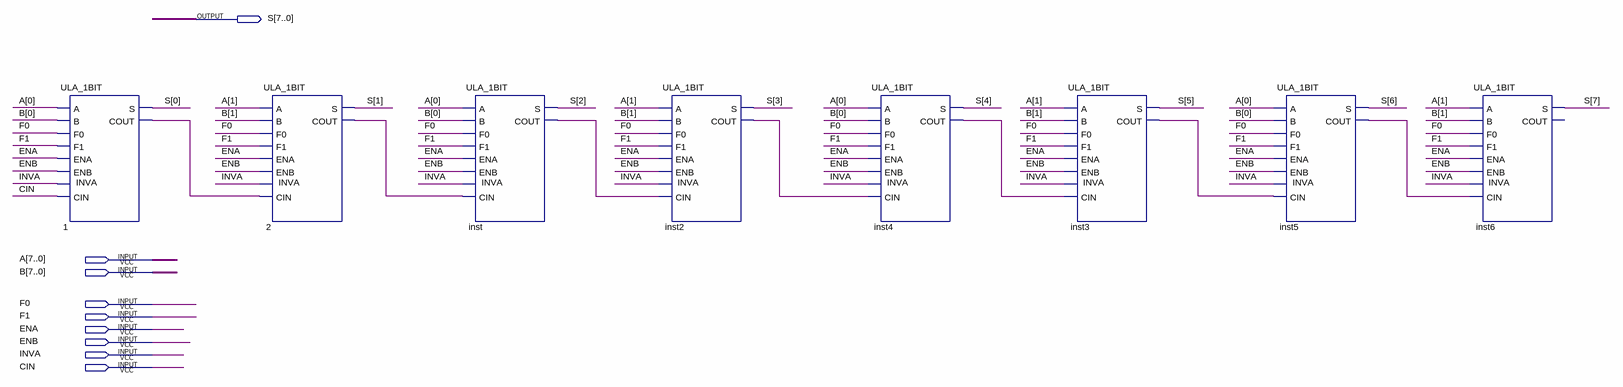
[diagram p0: schematic sheet]
// Quartus schematic ULA_8BIT.bdf as structural Verilog: 8 symbols, 9 pins
module ULA_8BIT (
  input  [7:0] A,
  input  [7:0] B,
  input  F0,
  input  F1,
  input  ENA,
  input  ENB,
  input  INVA,
  input  CIN,
  output [7:0] S
);

  wire inst2_cout, inst3_cout, inst4_cout, inst5_cout, inst_cout, n1_cout, n2_cout;

  ULA_1BIT u_1 (
    .INVA(INVA), .A(A[0]), .ENA(ENA), .B(B[0]), .ENB(ENB), .CIN(CIN), .F0(F0), .F1(F1), .S(S[0]),
    .COUT(n1_cout));
  ULA_1BIT u_2 (
    .INVA(INVA), .A(A[1]), .ENA(ENA), .B(B[1]), .ENB(ENB), .CIN(n1_cout), .F0(F0), .F1(F1), .S(S[1]),
    .COUT(n2_cout));
  ULA_1BIT inst (
    .INVA(INVA), .A(A[0]), .ENA(ENA), .B(B[0]), .ENB(ENB), .CIN(n2_cout), .F0(F0), .F1(F1), .S(S[2]),
    .COUT(inst_cout));
  ULA_1BIT inst2 (
    .INVA(INVA), .A(A[1]), .ENA(ENA), .B(B[1]), .ENB(ENB), .CIN(inst_cout), .F0(F0), .F1(F1), .S(S[3]),
    .COUT(inst2_cout));
  ULA_1BIT inst4 (
    .INVA(INVA), .A(A[0]), .ENA(ENA), .B(B[0]), .ENB(ENB), .CIN(inst2_cout), .F0(F0), .F1(F1), .S(S[4]),
    .COUT(inst4_cout));
  ULA_1BIT inst3 (
    .INVA(INVA), .A(A[1]), .ENA(ENA), .B(B[1]), .ENB(ENB), .CIN(inst4_cout), .F0(F0), .F1(F1), .S(S[5]),
    .COUT(inst3_cout));
  ULA_1BIT inst5 (
    .INVA(INVA), .A(A[0]), .ENA(ENA), .B(B[0]), .ENB(ENB), .CIN(inst3_cout), .F0(F0), .F1(F1), .S(S[6]),
    .COUT(inst5_cout));
  ULA_1BIT inst6 (
    .INVA(INVA), .A(A[1]), .ENA(ENA), .B(B[1]), .ENB(ENB), .CIN(inst5_cout), .F0(F0), .F1(F1), .S(S[7]));  // open: COUT
endmodule
